# EAGLE design BME_board-v1-6 (EAGLE 9.3.2)
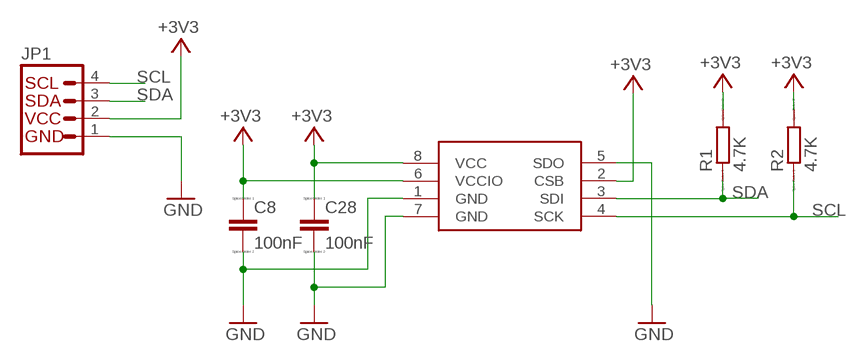
[diagram p0: schematic, sheet 1]

## Parts
C8  100nF  CC0603  [C0603]
C28  100nF  CC0603  [C0603]
IC2  BME280  [BME280]
JP1  I2C_STANDARD  [1X04]
R1  4.7K  RR0603  [R0603]
R2  4.7K  RR0603  [R0603]

## Nets
+3V3: C8.1 C28.1 IC2.2(CSB) IC2.6(VCCIO) IC2.8(VCC) JP1.2 R1.2 R2.2
GND: C8.2 C28.2 IC2.1(GND) IC2.5(SDO) IC2.7(GND) JP1.1
SCL: IC2.4(SCK) JP1.4 R2.1
SDA: IC2.3(SDI) JP1.3 R1.1

## Library data of the parts
C8 C28 = eagle-ltspice:C: CAPACITOR, European symbol; SPICEMODEL: NONE; SPICEPREFIX: C
IC2 = bosch-bme280:BME280: DIGITAL HUMIDITY, PRESSURE AND TEMPERATURE SENSOR * Digital interface I²C (up to 3.4 MHz) and SPI (3 and 4 wire, up to 10 MHz)* Supply voltage VDD main supply voltage range: 1.71 V to 3.6 V*VDDIO interface voltage range: 1.2 V to 3.6 V Operating range -40…+85 °C, 0…100 % rel. humidity, 300…1100 hPa The library has been designed by Richard Magdycz <https://www.facebook.com/groups/eaglecadsoftUK>
JP1 = SparkFun-Connectors:I2C_STANDARD: SparkFun has standardized on a pinout for all I2C based sensor breakouts. This pinout allows I2C boards to be plugged directly into the headers on Arduino Uno compatible boards, and to be daisy chained easily.
R1 R2 = eagle-ltspice:R: RESISTOR, European symbol; SPICEMODEL: NONE; SPICEPREFIX: R

## Board
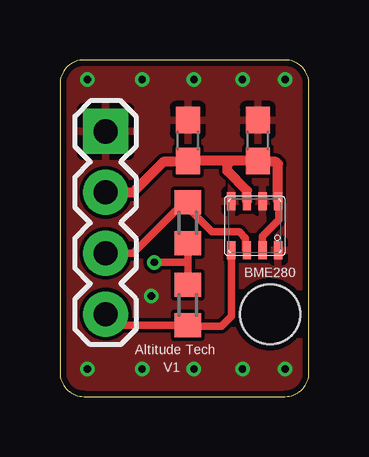
[diagram p1: board, top side]
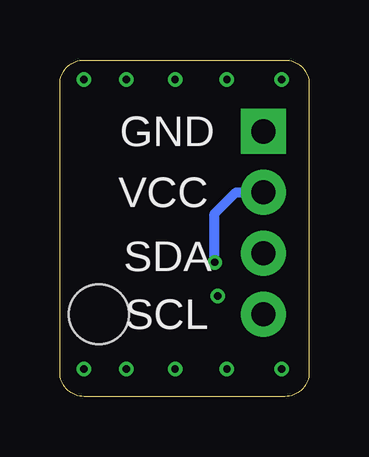
[diagram p2: board, bottom side, seen from below]

Size 10.39 x 14.02 mm. Coordinates in mm from the lower left corner, seen from the top.
Outline: 0,13.02 0,1 arc90 1,0 9.39,0 arc90 10.39,1 10.39,13.02 arc90 9.39,14.02 1,14.02 arc90 0,13.02
Copper layers (1*16): Top 0.035mm / dielectric 1.5mm / Bottom 0.035mm
Design rules "SeeedStudio_2layer_DRU_no_angle_20140221": minimum track width 6mil, minimum drill 12mil, track to track 6mil, track to pad 6mil, pad to pad 6mil, via to via 6mil, smd to smd 0mil, copper to edge 10mil, drill to drill 10mil, minimum pad ring 10mil, minimum via ring 6mil, stop-mask expansion 2mil, vias tented up to drill 100mil, thermal gap 10mil
Holes 2.5 mm at 8.76,3.43

### Footprints (pad centres in the part's own frame; a part is rotated, then mirrored left to right if it is on the bottom)
C0603 = smd 1.1 x 1: 1 -0.85,0; 2 0.85,0
BME280 = smd 0.35 x 0.75: 1 0.975,-1.025; 2 0.325,-1.025; 3 -0.325,-1.025; 4 -0.975,-1.025; 5 -0.975,1.025; 6 -0.325,1.025; 7 0.325,1.025; 8 0.975,1.025
1X04 = drill 1.016 pad 1.88 square: 1 0,0 | drill 1.016 pad 1.88: 2 2.54,0; 3 5.08,0; 4 7.62,0
R0603 = smd 1 x 1.1: 1 -0.85,0; 2 0.85,0

### Placement (x,y rotation side)
C8  5.33,10.67 90 top
C28  8.26,10.67 90 top
IC2  8.13,7.11 0 top
JP1  1.91,11.05 270 top
R1  5.33,7.24 270 top
R2  5.33,3.81 90 top

### Tracks (layer width: path | path; a pad name or v marks a point on that pad's centre or on a via)
+3V3  (via drill 0.3)
  Top 0.305: IC2.2 8.45,6.67 9.14,7.37 9.14,8.1 IC2.8 | R1.2 5.33,5.59 | 5.33,5.59 v3.94,5.59 | R2.2 5.33,5.59
  Top 0.406: JP1.2 3.05,8.51 4.32,9.78 5.29,9.78 C8.1 | IC2.6 7.8,8.58 6.99,9.4 6.99,9.65 | 6.99,9.65 6.99,9.78 | 5.37,9.78 C8.1 | IC2.8 9.1,9.69 9.02,9.78 8.29,9.78 C28.1 | C28.1 C8.1 | C28.1 7.15,9.82 6.99,9.65
  Bottom 0.406: v3.94,5.59 3.94,7.62 3.05,8.51 JP1.2
GND  (via drill 0.3)
  other vias: 1.14,1.14 3.43,1.14 5.59,1.14 7.62,1.14 9.4,1.14 3.81,4.19 1.14,13.21 3.43,13.21 5.59,13.21 7.62,13.21 9.4,13.21
  pour Top: 9.54,0 1,0 arc-90 0,1 0,12.97 arc-90 1,13.97 9.54,13.97 arc-90 10.54,12.97 10.54,1 arc-90
SCL
  Top 0.305: JP1.4 2.37,2.96 R2.1 5.37,2.92 6.73,2.92 7.15,3.34 IC2.4
SDA
  Top 0.305: 5.29,8.13 R1.1 | R1.1 5.33,7.87 6.35,6.86 7.49,6.86 7.75,6.6 7.75,6.14 IC2.3 | JP1.3 3.05,5.97 4.83,7.75 4.99,7.75 R1.1

### Text on the board
tNames: Altitude Tech | V1
bNames: GND | VCC | SDA | SCL